# EAGLE design CD_Welder (EAGLE 7.2.0)
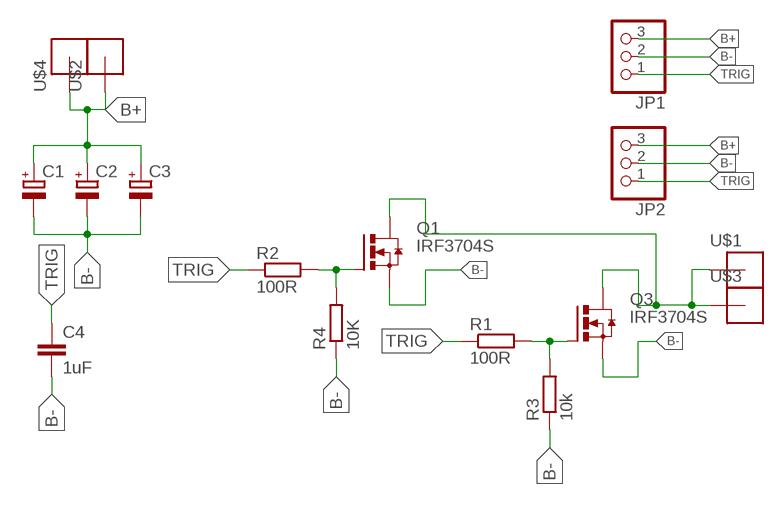
[diagram p0: schematic, sheet 1]

## Parts
C1  CPOL-EUE10-30  [EB30D]
C2  CPOL-EUE10-30  [EB30D]
C3  CPOL-EUE10-30  [EB30D]
C4  1uF  C-EUC1206  [C1206]
JP1  PINHD-1X3  [1X03]
JP2  PINHD-1X3  [1X03]
Q1  IRF3704S  [D2PACK]
Q3  IRF3704S  [D2PACK]
R1  100R  R-EU_R1206  [R1206]
R2  100R  R-EU_R1206  [R1206]
R3  10k  R-EU_R1206  [R1206]
R4  10K  R-EU_R1206  [R1206]
U$1  BIG_PINHEADX1M4  [M4_PINHEAD]
U$2  BIG_PINHEADX1M4  [M4_PINHEAD]
U$3  BIG_PINHEADX1M4  [M4_PINHEAD]
U$4  BIG_PINHEADX1M4  [M4_PINHEAD]

## Nets
B+: C1.+ C2.+ C3.+ JP1.3 JP2.3 U$2.P$1 U$4.P$1
B-: C1.- C2.- C3.- C4.2 JP1.2 JP2.2 Q1.3(S) Q3.3(S) R3.1 R4.1
N$1: Q1.2(D) Q3.2(D) U$1.P$1 U$3.P$1
N$2: Q1.1(G) R2.2 R4.2
N$6: Q3.1(G) R1.2 R3.2
TRIG: C4.1 JP1.1 JP2.1 R1.1 R2.1

## Library data of the parts
C1-C3 = resistor:CPOL-EU: POLARIZED CAPACITOR, European symbol
C4 = resistor:C-EU: CAPACITOR, European symbol
JP1 JP2 = pinhead:PINHD-1X3: PIN HEADER
Q1 Q3 = transistor-power:IRF3704: SMPS MOSFET HEXFET® Power MOSFET Source: http://www.irf.com/product-info/datasheets/data/irf3704.pdf
R1-R4 = resistor:R-EU_: RESISTOR, European symbol
U$1-U$4 = Ians parts:BIG_PINHEADX1

## Board
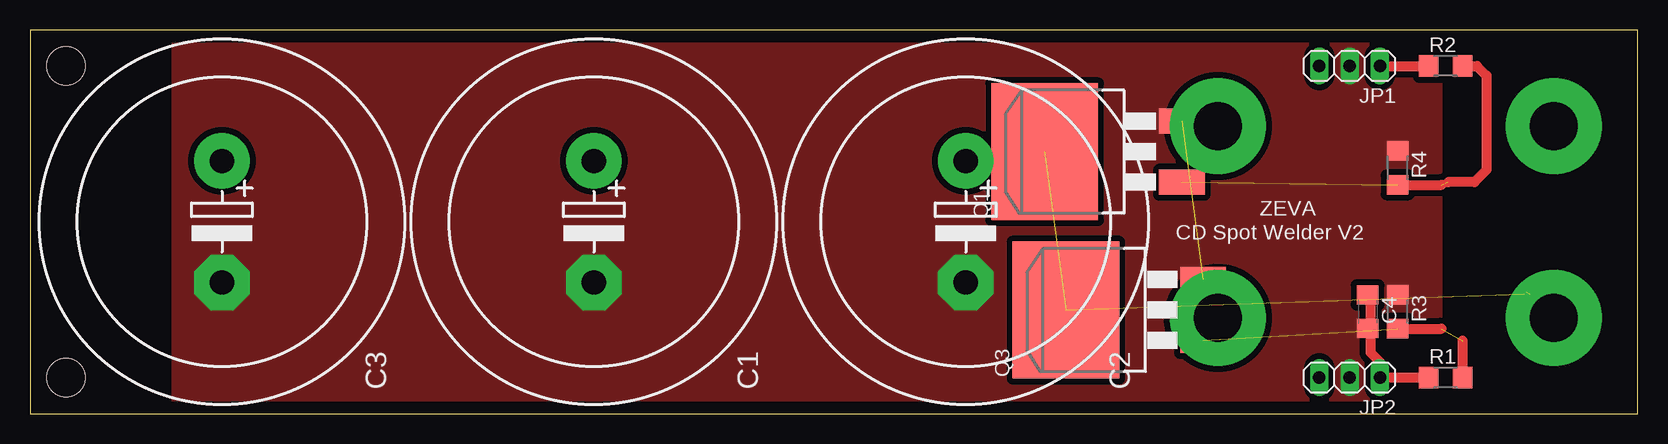
[diagram p1: board, top side]
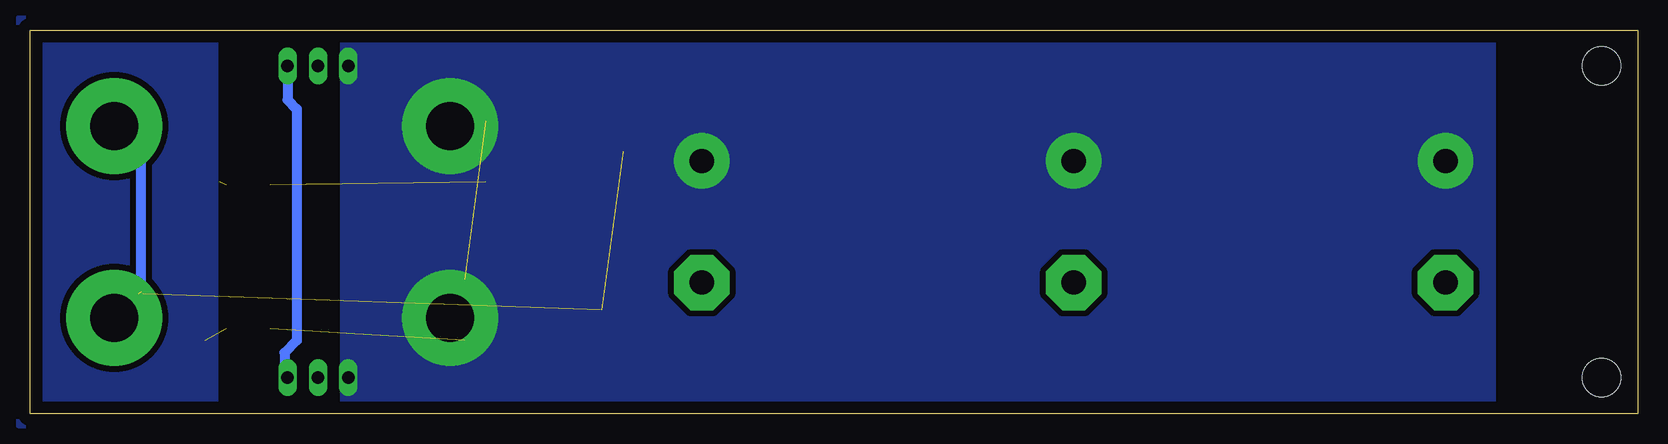
[diagram p2: board, bottom side, seen from below]

Size 134 x 32 mm. Coordinates in mm from the lower left corner, seen from the top.
Outline: 0,0 134,0 134,32 0,32 0,0
Copper layers (1*16): Top 0.035mm / dielectric 1.5mm / Bottom 0.035mm
Design rules "default": minimum track width 10mil, minimum drill 24mil, track to track 8mil, track to pad 8mil, pad to pad 8mil, via to via 8mil, smd to smd 8mil, copper to edge 40mil, drill to drill 8mil, minimum pad ring 10mil, minimum via ring 8mil, stop-mask expansion 4mil, vias tented up to drill 0mil, thermal gap 10mil
Holes 3.2 mm at 3,29 3,3

### Footprints (pad centres in the part's own frame; a part is rotated, then mirrored left to right if it is on the bottom)
EB30D = drill 2.007 pad 4.597: + -5.08,0 | drill 2.007 pad 4.597 octagon: - 5.08,0
C1206 = smd 1.6 x 1.8: 1 -1.4,0; 2 1.4,0
1X03 = drill 1.016 long: 1 -2.54,0; 2 0,0; 3 2.54,0
D2PACK = smd 2.083 x 3.81: 1 -2.54,-8.89; 3 2.54,-8.89 | smd 11.43 x 8.89: 2 0,2.54
R1206 = smd 1.6 x 1.803: 1 -1.422,0; 2 1.422,0
M4_PINHEAD = drill 4 pad 8: P$1 0,0

### Placement (x,y rotation side)
C1  47,16 270 top
C2  78,16 270 top
C3  16,16 270 top
C4  111.5,8.5 270 top
JP1  110,29 180 top
JP2  110,3 180 top
Q1  87.12,21.84 90 top
Q3  88.9,8.64 90 top
R1  118,3 0 top
R2  118,29 0 top
R3  114,8.5 270 top
R4  114,20.5 270 top
U$1  127,24 0 top
U$2  99,24 0 top
U$3  127,8 0 top
U$4  99,8 0 top

### Tracks (layer width: path | path; a pad name or v marks a point on that pad's centre or on a via)
B+
  pour Bottom (isolate 0.5, no thermals): 12,34 108,34 108,-3 12,-3
B-  (1 unrouted)
  pour Top (isolate 0.5, no thermals): 12,33 117.5,33 117.5,-1 12,-1
D
  pour Bottom (isolate 0.5, no thermals): 118.5,33 135,33 135,-1 118.5,-1
N$1  (3 unrouted)
  Bottom 0.813: U$1.P$1 124.71,21.71 124.71,10.16 124.55,10 | 125,10 U$3.P$1
N$2  (2 unrouted)
  Top 0.813: R2.2 120.61,29 121.41,28.19 121.41,20.32 120.4,19.3 118.2,19.3 | R4.2 117.66,19.08
N$6  (2 unrouted)
  Top 0.813: R3.2 117.66,7.08 | R1.2 119.42,6.08
TRIG
  Top 0.813: JP1.1 R2.1 | R1.1 JP2.1 112.54,4.3 111.76,5.08 111.76,9.64 C4.1
  Bottom 0.813: JP1.1 112.54,26.18 111.76,25.4 111.76,6.1 112.78,5.08 112.78,3.24 JP2.1

### Text on the board
tPlace: ZEVA | CD Spot Welder V2